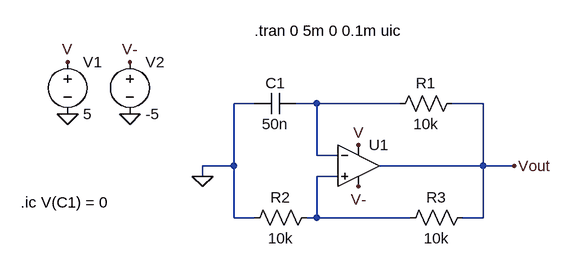
[diagram p0: schematic square-wave-relaxation-oscillator.asc]
square-wave-relaxation-oscillator.asc, the LTspice schematic file:
Version 4
SHEET 1 880 680
WIRE 64 64 32 64
WIRE 160 64 128 64
WIRE 288 64 160 64
WIRE 416 64 368 64
WIRE 160 144 160 64
WIRE 192 144 160 144
WIRE 32 160 32 64
WIRE 32 160 -16 160
WIRE 416 160 416 64
WIRE 416 160 256 160
WIRE 464 160 416 160
WIRE -16 176 -16 160
WIRE 192 176 160 176
WIRE 32 240 32 160
WIRE 64 240 32 240
WIRE 160 240 160 176
WIRE 160 240 144 240
WIRE 304 240 160 240
WIRE 416 240 416 160
WIRE 416 240 384 240
FLAG -16 176 0
FLAG -224 80 0
FLAG -128 80 0
FLAG -224 0 V
FLAG -128 0 V-
FLAG 224 192 V-
FLAG 224 128 V
FLAG 464 160 Vout
SYMBOL OpAmps\\UniversalOpamp2 224 160 R0
SYMATTR InstName U1
SYMBOL cap 128 48 R90
WINDOW 0 0 32 VBottom 2
WINDOW 3 32 32 VTop 2
SYMATTR InstName C1
SYMATTR Value 50n
SYMBOL res 384 48 R90
WINDOW 0 0 56 VBottom 2
WINDOW 3 32 56 VTop 2
SYMATTR InstName R1
SYMATTR Value 10k
SYMBOL res 160 224 R90
WINDOW 0 0 56 VBottom 2
WINDOW 3 32 56 VTop 2
SYMATTR InstName R2
SYMATTR Value 10k
SYMBOL res 400 224 R90
WINDOW 0 0 56 VBottom 2
WINDOW 3 32 56 VTop 2
SYMATTR InstName R3
SYMATTR Value 10k
SYMBOL voltage -224 -16 R0
WINDOW 123 0 0 Left 0
WINDOW 39 0 0 Left 0
SYMATTR InstName V1
SYMATTR Value 5
SYMBOL voltage -128 -16 R0
WINDOW 123 0 0 Left 0
WINDOW 39 0 0 Left 0
SYMATTR InstName V2
SYMATTR Value -5
TEXT 64 -48 Left 2 !.tran 0 5m 0 0.1m uic
TEXT -296 216 Left 2 !.ic V(C1) = 0

The netlist it stands for:
* square-wave-relaxation-oscillator.asc
XU1 N002 N001 V V- Vout level.2 Avol=1Meg GBW=10Meg Slew=10Meg ilimit=25m rail=0 Vos=0 phimargin=45 en=0 enk=0 in=0 ink=0 Rin=500Meg  ; pins IN+ IN- V+ V- OUT
C1 N001 0 50n
R1 Vout N001 10k
R2 N002 0 10k
R3 Vout N002 10k
V1 V 0 5
V2 V- 0 -5
.tran 0 5m 0 0.1m uic
.ic V(C1) = 0
.lib UniversalOpamps2.sub
.backanno
.end